# Altium project RamanPowerBoard.PrjPcb
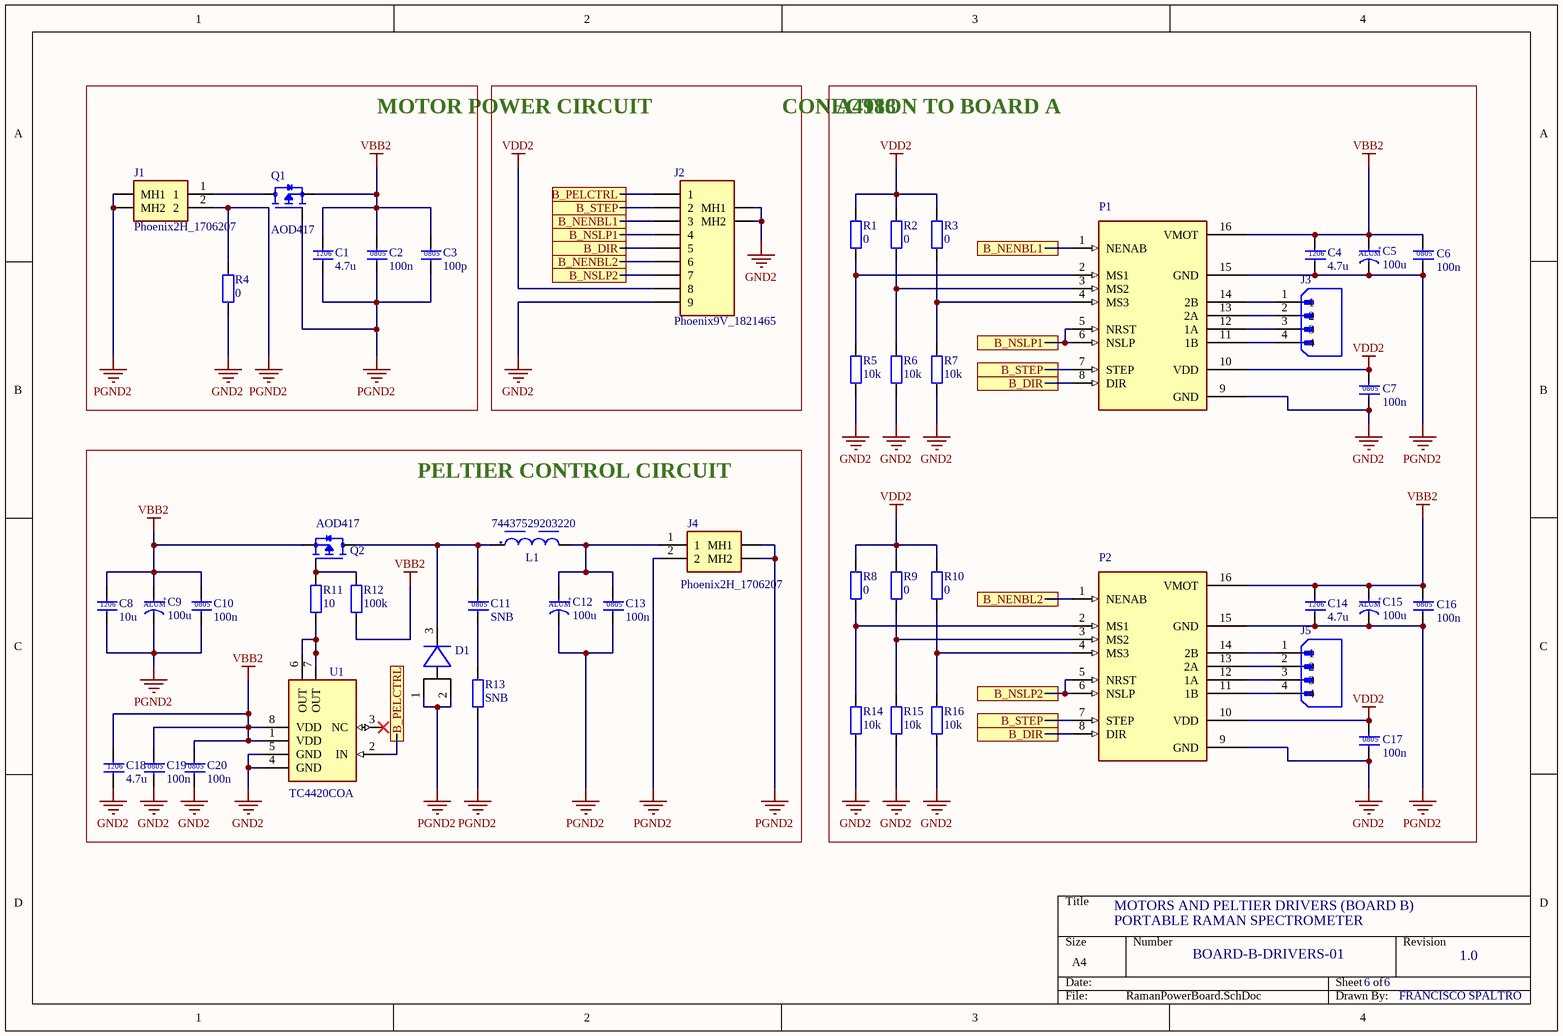
[diagram p0: RamanPowerBoard.SchDoc]
1 sheet, 48 parts. Net scope: global (net labels, ports and power ports of the same name join across sheets).
Board file: PCB1.PcbDoc

## Sheet RamanPowerBoard.SchDoc
size A4; SheetNumber: 1; SheetTotal: 1

### Parts
C1  4.7u  [CAP_1206]
C2  100n  [RES_0805]
C3  100p  [RES_0805]
C4  4.7u  [CAP_1206]
C5  100u  [CAP_EEFK_D8_PAN-M]
C6  100n  [RES_0805]
C7  100n  [RES_0805]
C8  10u  [CAP_1206]
C9  100u  [CAP_EEFK_D8_PAN-M]
C10  100n  [RES_0805]
C11  SNB  [RES_0805]
C12  100u  [CAP_EEFK_D8_PAN-M]
C13  100n  [RES_0805]
C14  4.7u  [CAP_1206]
C15  100u  [CAP_EEFK_D8_PAN-M]
C16  100n  [RES_0805]
C17  100n  [RES_0805]
C18  4.7u  [CAP_1206]
C19  100n  [RES_0805]
C20  100n  [RES_0805]
D1  DIODE_FSV15150V  [FSV15150V_TO-277]  (value not drawn)
J1  Phoenix2H_1706207  [PHOENIX_1706207]
J2  Phoenix9V_1821465  [PHOENIX_1821465]
J3  Molex_4P  [MOLEX_436500402]  (value not drawn)
J4  Phoenix2H_1706207  [PHOENIX_1706207]
J5  Molex_4P  [MOLEX_436500402]  (value not drawn)
L1  74437529203220  [WE-HCF_2920_ROUND]
P1  2x8_PINES  [PINES8x2-sep]  (value not drawn)
P2  2x8_PINES  [PINES8x2-sep]  (value not drawn)
Q1  AOD417  [DPAK228P994X240_3N]
Q2  AOD417  [DPAK228P994X240_3N]
R1  0  [RES_0805]
R2  0  [RES_0805]
R3  0  [RES_0805]
R4  0  [RES_0805]
R5  10k  [RES_0805]
R6  10k  [RES_0805]
R7  10k  [RES_0805]
R8  0  [RES_0805]
R9  0  [RES_0805]
R10  0  [RES_0805]
R11  10  [RES_0805]
R12  100k  [RES_0805]
R13  SNB  [RES_0805]
R14  10k  [RES_0805]
R15  10k  [RES_0805]
R16  10k  [RES_0805]
U1  TC4420COA  [SOIC127P599X175-8N]

### Blocks framed on the sheet
MOTOR POWER CIRCUIT: C1-C3 J1 Q1 R4
CONECTION TO BOARD A: J2
A4988: C4-C7 C14-C17 J3 J5 P1 P2 R1-R3 R5-R10 R14-R16
PELTIER CONTROL CIRCUIT: C8-C13 C18-C20 D1 J4 L1 Q2 R11-R13 U1

### Nets
GND2: C7.2 C17.2 C18.2 C19.2 C20.2 J2.9 J2.MH1 J2.MH2 P1.9(GND) P2.9(GND) R4.1 R5.1 R6.1 R7.1 R14.1 R15.1 R16.1 U1.4(GND) U1.5(GND)
PGND2: C1.2 C2.2 C3.2 C4.2 C5.2 C6.2 C8.2 C9.2 C10.2 C12.2 C13.2 C14.2 C15.2 C16.2 D1.1(A) D1.2 J1.2 J1.MH1 J1.MH2 J4.2 J4.MH1 J4.MH2 P1.15(GND) P2.15(GND) Q1.1(G) R4.2 R13.1
VBB2: C1.1 C2.1 C3.1 C4.1 C5.1 C6.1 C8.1 C9.1 C10.1 C14.1 C15.1 C16.1 C18.1 C19.1 C20.1 P1.16(VMOT) P2.16(VMOT) Q1.3(S) Q2.3(S) R12.1 U1.1(VDD) U1.8(VDD)
VDD2: C7.1 C17.1 J2.8 P1.10(VDD) P2.10(VDD) R1.2 R2.2 R3.2 R8.2 R9.2 R10.2
B_DIR: J2.5 P1.8(DIR) P2.8(DIR)
B_NENBL1: J2.3 P1.1(NENAB)
B_NENBL2: J2.6 P2.1(NENAB)
B_NSLP1: J2.4 P1.5(NRST) P1.6(NSLP)
B_NSLP2: J2.7 P2.5(NRST) P2.6(NSLP)
B_PELCTRL: J2.1 U1.2(IN)
B_STEP: J2.2 P1.7(STEP) P2.7(STEP)
NetC11_1: C11.1 D1.3(C) L1.1 Q2.4(D)
NetC11_2: C11.2 R13.2
NetC12_1: C12.1 C13.1 J4.1 L1.2
NetJ1_1: J1.1 Q1.4(D)
NetJ3_1: J3.1 P1.14(2B)
NetJ3_2: J3.2 P1.13(2A)
NetJ3_3: J3.3 P1.12(1A)
NetJ3_4: J3.4 P1.11(1B)
NetJ5_1: J5.1 P2.14(2B)
NetJ5_2: J5.2 P2.13(2A)
NetJ5_3: J5.3 P2.12(1A)
NetJ5_4: J5.4 P2.11(1B)
NetP1_2: P1.2(MS1) R1.1 R5.2
NetP1_3: P1.3(MS2) R2.1 R6.2
NetP1_4: P1.4(MS3) R3.1 R7.2
NetP2_2: P2.2(MS1) R8.1 R14.2
NetP2_3: P2.3(MS2) R9.1 R15.2
NetP2_4: P2.4(MS3) R10.1 R16.2
NetQ2_1: Q2.1(G) R11.2 R12.2
NetR11_1: R11.1 U1.6(OUT) U1.7(OUT)

Not connected (* = marked no-connect by the designer): U1 3(NC)*

### Notes on the sheet
- MOTORS AND PELTIER DRIVERS (BOARD B)
- PORTABLE RAMAN SPECTROMETER
- BOARD-B-DRIVERS-01
- 6
- 1.0
- FRANCISCO SPALTRO
- (in symbol CAP_0805) 0805
- (in symbol CAP_1206) 1206
- (in symbol CAP_RAD_POL) +; ALUM

### Library data of the parts
C1 C4 C14 C18 = CAP_1206: Taiyo Yuden UMK316AB7475KL-T
C2 C3 C6 C7 C10 C11 C13 C16 C17 C19 C20 = CAP_0805: 0805 Capacitor without polarity
C5 C9 C12 C15 = CAP_RAD_POL: Panasonic EEE-FK1V101XP
C8 = CAP_1206: Samsung CL31A106KAHNNNE
J2 = Phoenix9V_1821465: MF: {'manufacturer': u'Phoenix Contact'}; Package: None; Price: None; Value: *; MP: 1821465; Availability: Unavailable
J3 J5 = Molex_4P: Connector Header Through Hole, Right Angle 4 position 0.118 (3.00mm) (Molex 436500402); SnapEDA_Link: https://www.snapeda.com/parts/436500402/Molex/view-part/?ref=snap; Package: None; Value: *; MF: Molex; MP: 436500402; Check_prices: https://www.snapeda.com/parts/436500402/Molex/view-part/?ref=eda
L1 = 22uH_74437529203220: MF: {'manufacturer': u'W\xfcrth Elektronik'}; Package: None; Price: None; Value: *; MP: 74437529203220; Availability: Unavailable
Q1 Q2 = AOD417: P-Channel 30V 25A _Ta_ 2.5W _Ta_, 50W _Tc_ Surface Mount TO-252, _D-Pak_; MF: Alpha &; SnapEDA_Link: https://www.snapeda.com/parts/AOD417/Alpha%20%26%20Omega%20Semiconductor%20Inc./view-part/454934/?ref=snap; Availability: Unavailable; MP: AOD417; Price: None; Package: TO-252 Alpha &amp; Omega Semiconductor; Value: *
R1-R16 = RES_0805: Generic Capacitor
U1 = TC4420COA: Microchip TC4420COA,MOSFET Power Driver 6A,4.5 to 18V,Non-Inverting,8-Pin SOIC | Microchip Technology Inc. TC4420COA; SnapEDA_Link: https://www.snapeda.com/parts/TC4420COA/Microchip/view-part/?ref=snap; Package: SOIC-8 Microchip; Value: *; MF: Microchip Technology; MP: TC4420COA; Check_prices: https://www.snapeda.com/parts/TC4420COA/Microchip/view-part/?ref=eda
J1 J4 = Phoenix2H_1706207: Package: None; Price: None; Value: *; MP: 1706207; Availability: Unavailable